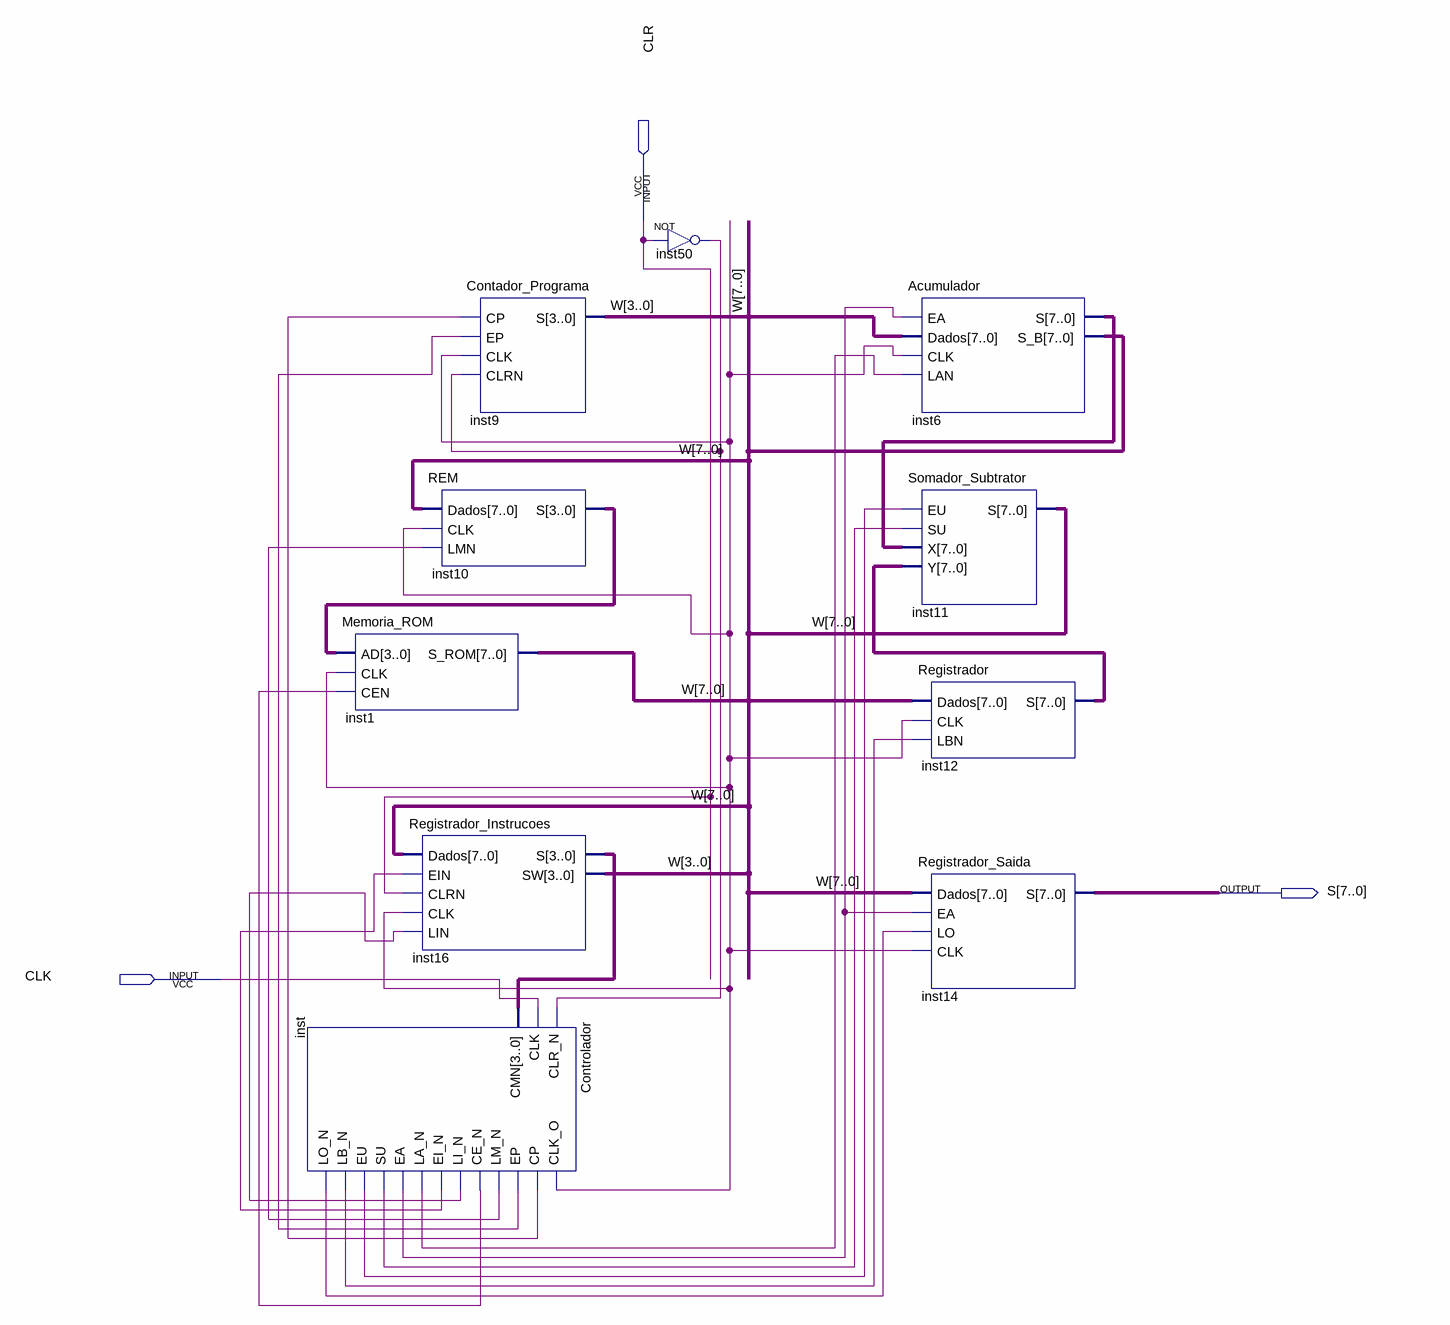
[diagram p0: schematic sheet]
// Quartus schematic MicroComputador.bdf as structural Verilog: 10 symbols, 3 pins
module MicroComputador (
  input  CLR,
  input  CLK,
  output [7:0] S
);

  wire inst50_out, inst_ce_n, inst_clk_o, inst_cp, inst_ea, inst_ei_n, inst_ep, inst_eu, inst_la_n,
       inst_lb_n, inst_li_n, inst_lm_n, inst_lo_n, inst_su;
  wire [3:0] inst10_s, inst16_s;
  wire [7:0] inst6_s, inst12_s, W;

  Controlador inst (
    .CLR_N(inst50_out), .CLK(CLK), .CMN(inst16_s), .CLK_O(inst_clk_o), .CP(inst_cp), .EP(inst_ep),
    .LM_N(inst_lm_n), .CE_N(inst_ce_n), .LI_N(inst_li_n), .EI_N(inst_ei_n), .LA_N(inst_la_n), .EA(inst_ea),
    .SU(inst_su), .EU(inst_eu), .LB_N(inst_lb_n), .LO_N(inst_lo_n));
  Memoria_ROM inst1 (.AD(inst10_s), .CLK(inst_clk_o), .CEN(inst_ce_n), .S_ROM(W));
  Contador_Programa inst9 (.CP(inst_cp), .EP(inst_ep), .CLK(inst_clk_o), .CLRN(inst50_out), .S(W[3:0]));
  REM inst10 (.Dados(W), .CLK(inst_clk_o), .LMN(inst_lm_n), .S(inst10_s));
  Registrador_Instrucoes inst16 (
    .Dados(W), .EIN(inst_ei_n), .CLRN(CLR), .CLK(inst_clk_o), .LIN(inst_li_n), .S(inst16_s), .SW(W[3:0]));
  not inst50 (inst50_out, CLR);
  Acumulador inst6 (.EA(inst_ea), .Dados(W), .CLK(inst_clk_o), .LAN(inst_la_n), .S(inst6_s), .S_B(W));
  Somador_Subtrator inst11 (.EU(inst_eu), .SU(inst_su), .X(inst6_s), .Y(inst12_s), .S(W));
  Registrador inst12 (.Dados(W), .CLK(inst_clk_o), .LBN(inst_lb_n), .S(inst12_s));
  Registrador_Saida inst14 (.Dados(W), .EA(inst_ea), .LO(inst_lo_n), .CLK(inst_clk_o), .S(S));
endmodule
